# EAGLE design pda6502 (EAGLE 7.1.0)
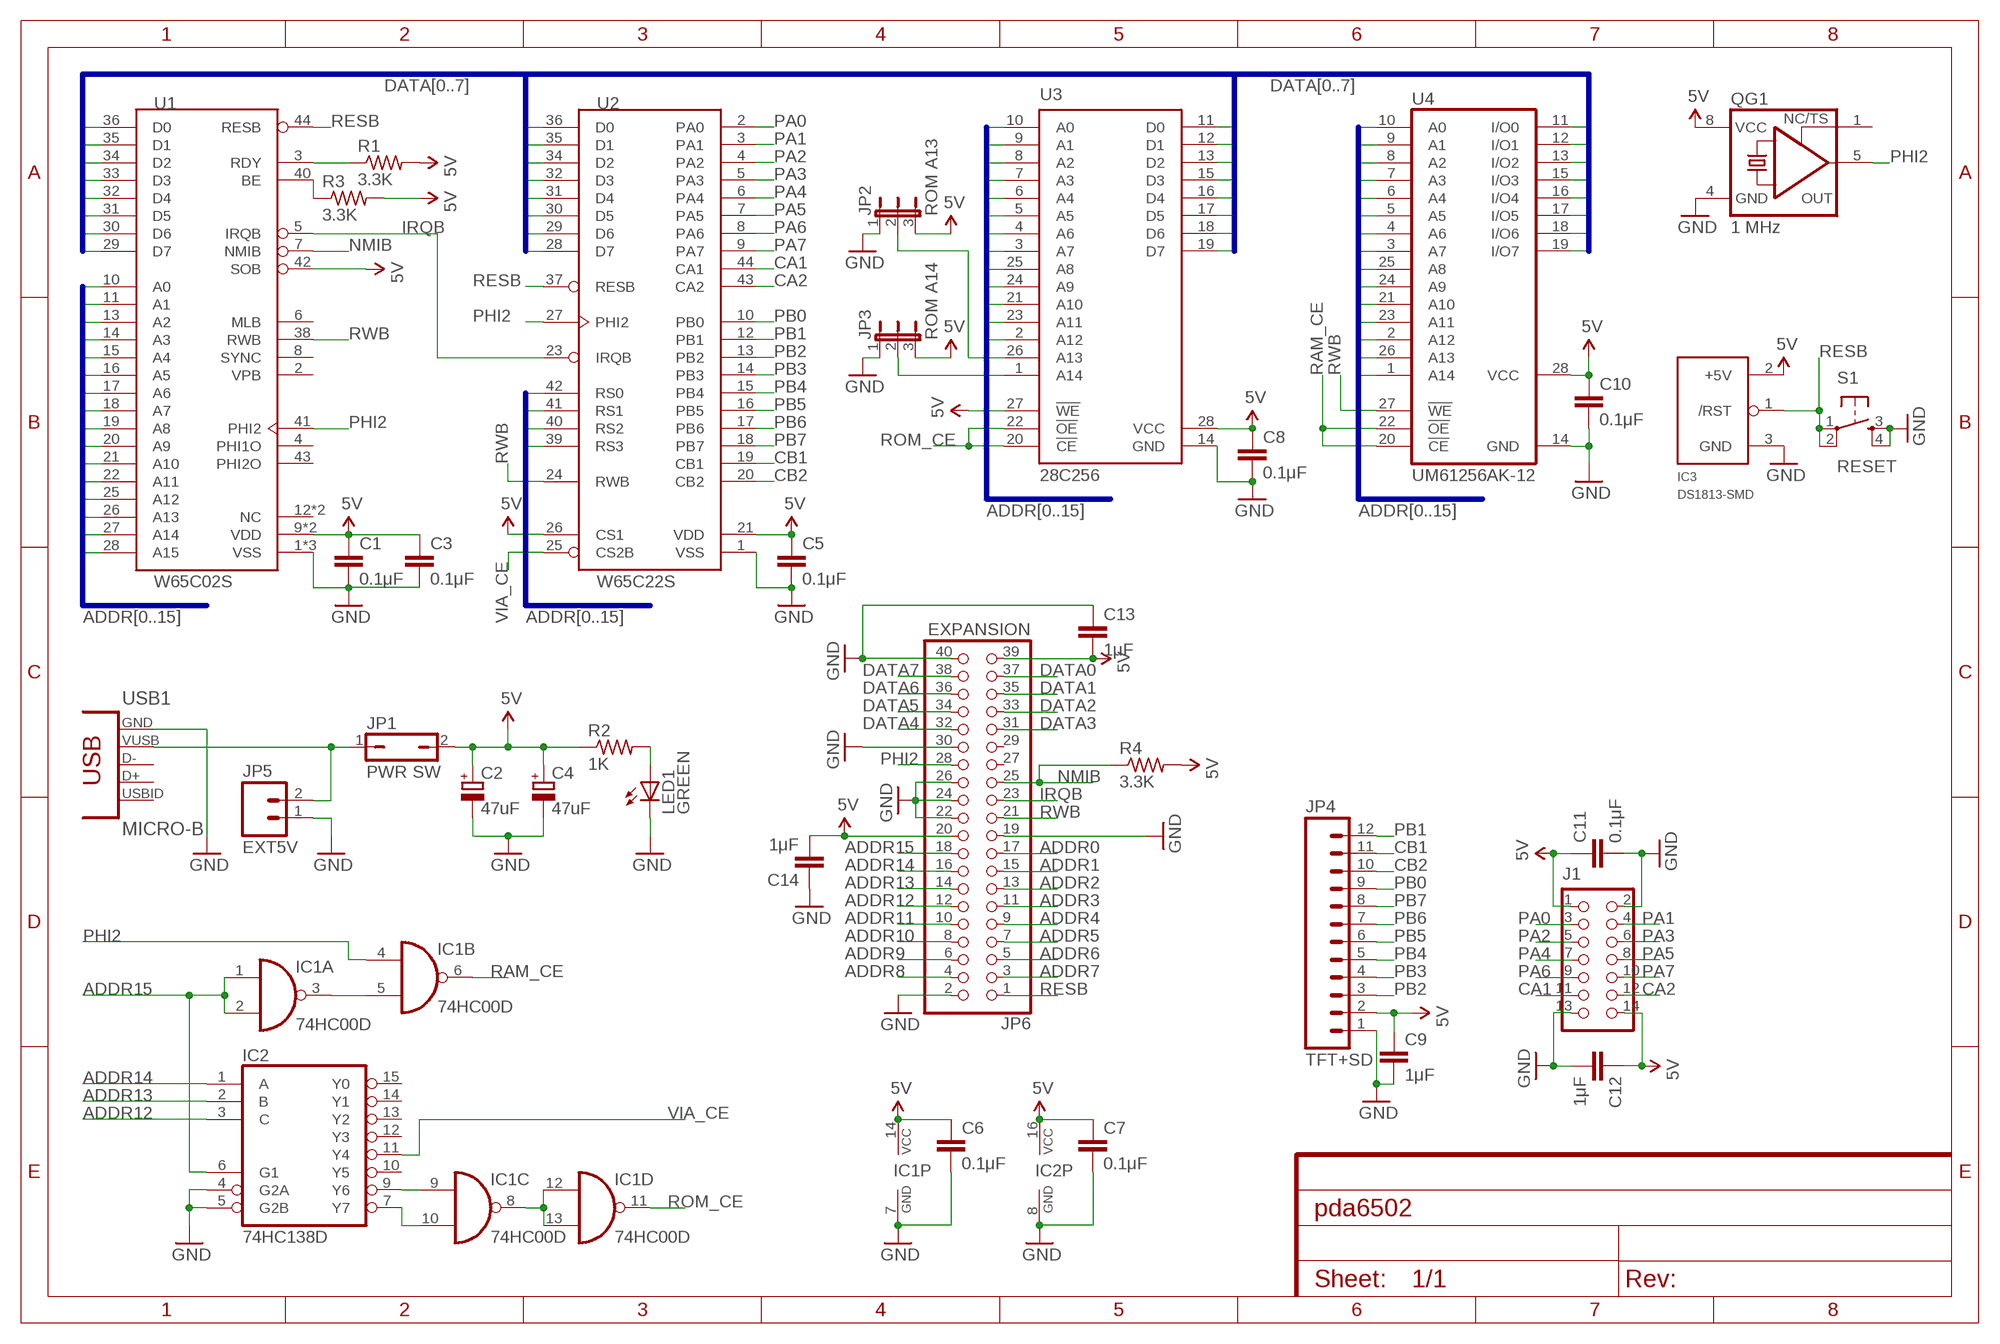
[diagram p0: schematic, sheet 1]
FRAME1 (FRAME-A4L): CNAME: pda; CREVISION: 1.0; DESIGNER: pda

## Parts
C1  0.1μF  C-EUC0805  [C0805]
C2  47uF  CAPACITOR_POL-CASE_B  [CASE_B]
C3  0.1μF  C-EUC0805  [C0805]
C4  47uF  CAPACITOR_POL-CASE_B  [CASE_B]
C5  0.1μF  C-EUC0805  [C0805]
C6  0.1μF  C-EUC0805  [C0805]
C7  0.1μF  C-EUC0805  [C0805]
C8  0.1μF  C-EUC0805  [C0805]
C9  1μF  C-EUC0805  [C0805]
C10  0.1μF  C-EUC0805  [C0805]
C11  0.1μF  C-EUC0805  [C0805]
C12  1μF  C-EUC0805  [C0805]
C13  1μF  C-EUC0805  [C0805]
C14  1μF  C-EUC0805  [C0805]
IC1  74HC00D  [SO14]
IC2  74HC138D  [SO16]
IC3  DS1813-SMD  [SOT-23]
J1  CON_HEADER_2X07-PTH  [M2X7]
JP1  PWR SW  JMP-1X2TH  [JMP-1X2]
JP2  ROM A13  JP2E  [JP2]
JP3  ROM A14  JP2E  [JP2]
JP4  TFT+SD  M121X12_NO_SILK_KIT  [1X12_NO_SILK_KIT]
JP5  EXT5V  M02PTH  [1X02]
JP6  EXPANSION  PINHD-2X20  [2X20]
LED1  GREEN  LED-0805  [LED-805]
QG1  1 MHz  XO-8  [DIL08S]
R1  3.3K  R-US_R0805  [R0805]
R2  1K  R-US_R0805  [R0805]
R3  3.3K  R-US_R0805  [R0805]
R4  3.3K  R-US_R0805  [R0805]
S1  RESET  TAC_SWITCHSMD  [TACTILE-SWITCH-SMD]
U1  W65C02S  W65C02PLCC44  [PLCC44-SOCKET]
U2  W65C22S  W65C22PLCC44-SOCKET  [PLCC44-SOCKET]
U3  28C256  28C256-ZIF  [ZIF28-6-WIDE]
U4  UM61256AK-12  [DIL28-3]
USB1  MICRO-B  CON-USB-F-MICRO-B  [CONN_USB_MICRO-B]

## Nets
5V: C1.1 C2.+ C3.1 C4.+ C5.1 C6.1 C7.1 C8.1 C9.1 C10.1 C11.1 C12.1 C13.2 C14.2 IC1.14(P:VCC) IC2.16(VCC) IC3.2(+5V) J1.1 J1.14 JP1.2 JP2.3 JP3.3 JP4.2 JP6.20 JP6.39 QG1.8(VCC) R1.2 R2.1 R3.2 R4.2 U1.9(VDD) U1.37(VDD) U1.42(SOB) U2.21(VDD) U2.26(CS1) U3.27(!WE) U3.28(VCC) U4.28(VCC)
ADDR0: JP6.17 U1.10(A0) U2.42(RS0) U3.10(A0) U4.10(A0)
ADDR1: JP6.15 U1.11(A1) U2.41(RS1) U3.9(A1) U4.9(A1)
ADDR2: JP6.13 U1.13(A2) U2.40(RS2) U3.8(A2) U4.8(A2)
ADDR3: JP6.11 U1.14(A3) U2.39(RS3) U3.7(A3) U4.7(A3)
ADDR4: JP6.9 U1.15(A4) U3.6(A4) U4.6(A4)
ADDR5: JP6.7 U1.16(A5) U3.5(A5) U4.5(A5)
ADDR6: JP6.5 U1.17(A6) U3.4(A6) U4.4(A6)
ADDR7: JP6.3 U1.18(A7) U3.3(A7) U4.3(A7)
ADDR8: JP6.4 U1.19(A8) U3.25(A8) U4.25(A8)
ADDR9: JP6.6 U1.20(A9) U3.24(A9) U4.24(A9)
ADDR10: JP6.8 U1.21(A10) U3.21(A10) U4.21(A10)
ADDR11: JP6.10 U1.22(A11) U3.23(A11) U4.23(A11)
ADDR12: IC2.3(C) JP6.12 U1.25(A12) U3.2(A12) U4.2(A12)
ADDR13: IC2.2(B) JP6.14 U1.26(A13) U4.26(A13)
ADDR14: IC2.1(A) JP6.16 U1.27(A14) U4.1(A14)
ADDR15: IC1.1(A:I0) IC1.2(A:I1) IC2.6(G1) JP6.18 U1.28(A15)
CA1: J1.11 U2.44(CA1)
CA2: J1.12 U2.43(CA2)
CB1: JP4.11 U2.19(CB1)
CB2: JP4.10 U2.20(CB2)
DATA0: JP6.37 U1.36(D0) U2.36(D0) U3.11(D0) U4.11(I/O0)
DATA1: JP6.35 U1.35(D1) U2.35(D1) U3.12(D1) U4.12(I/O1)
DATA2: JP6.33 U1.34(D2) U2.34(D2) U3.13(D2) U4.13(I/O2)
DATA3: JP6.31 U1.33(D3) U2.32(D3) U3.15(D3) U4.15(I/O3)
DATA4: JP6.32 U1.32(D4) U2.31(D4) U3.16(D4) U4.16(I/O4)
DATA5: JP6.34 U1.31(D5) U2.30(D5) U3.17(D5) U4.17(I/O5)
DATA6: JP6.36 U1.30(D6) U2.29(D6) U3.18(D6) U4.18(I/O6)
DATA7: JP6.38 U1.29(D7) U2.28(D7) U3.19(D7) U4.19(I/O7)
GND: C1.2 C2.- C3.2 C4.- C5.2 C6.2 C7.2 C8.2 C9.2 C10.2 C11.2 C12.2 C13.1 C14.1 IC1.7(P:GND) IC2.4(G2A) IC2.5(G2B) IC2.8(GND) IC3.3(GND) J1.2 J1.13 JP2.1 JP3.1 JP4.1 JP5.1 JP6.2 JP6.19 JP6.22 JP6.24 JP6.26 JP6.30 JP6.40 LED1.C QG1.4(GND) S1.3 S1.4 U1.1(VSS) U1.23(VSS) U1.24(VSS) U2.1(VSS) U3.14(GND) U4.14(GND) USB1.P5(GND)
IRQB: JP6.23 U1.5(IRQB) U2.23(IRQB)
N$1: LED1.A R2.2
N$2: IC1.10(C:I1) IC2.7(Y7)
N$3: IC1.9(C:I0) IC2.9(Y6)
N$4: JP1.1 JP5.2 USB1.P1(VUSB)
N$5: IC1.8(C:O) IC1.12(D:I0) IC1.13(D:I1)
N$6: JP3.2 U3.1(A14)
N$7: IC1.3(A:O) IC1.5(B:I1)
N$8: R3.1 U1.40(BE)
N$9: R1.1 U1.3(RDY)
N$10: JP2.2 U3.26(A13)
NMIB: JP6.25 R4.1 U1.7(NMIB)
PA0: J1.3 U2.2(PA0)
PA1: J1.4 U2.3(PA1)
PA2: J1.5 U2.4(PA2)
PA3: J1.6 U2.5(PA3)
PA4: J1.7 U2.6(PA4)
PA5: J1.8 U2.7(PA5)
PA6: J1.9 U2.8(PA6)
PA7: J1.10 U2.9(PA7)
PB0: JP4.9 U2.10(PB0)
PB1: JP4.12 U2.12(PB1)
PB2: JP4.3 U2.13(PB2)
PB3: JP4.4 U2.14(PB3)
PB4: JP4.5 U2.15(PB4)
PB5: JP4.6 U2.16(PB5)
PB6: JP4.7 U2.17(PB6)
PB7: JP4.8 U2.18(PB7)
PHI2: IC1.4(B:I0) JP6.28 QG1.5(OUT) U1.41(PHI2) U2.27(PHI2)
RAM_CE: IC1.6(B:O) U4.20(!CE) U4.22(!OE)
RESB: IC3.1(/RST) JP6.1 S1.1 S1.2 U1.44(RESB) U2.37(RESB)
ROM_CE: IC1.11(D:O) U3.20(!CE) U3.22(!OE)
RWB: JP6.21 U1.38(RWB) U2.24(RWB) U4.27(!WE)
VIA_CE: IC2.11(Y4) U2.25(CS2B)
Unconnected: IC2.10(Y5) IC2.12(Y3) IC2.13(Y2) IC2.14(Y1) IC2.15(Y0) JP6.27 JP6.29 QG1.1(TS) U1.2(VPB) U1.4(PHI1O) U1.6(MLB) U1.8(SYNC) U1.12(NC) U1.39(NC) U1.43(PHI2O) USB1.BODY@1(BODY) USB1.BODY@2(BODY) USB1.BODY@3(BODY) USB1.BODY@4(BODY) USB1.P2(D-) USB1.P3(D+) USB1.P4(USBID)

## Buses
DATA[0..7]
ADDR[0..15]

## Library data of the parts
C1 C3 C5-C14 = rcl:C-EU: CAPACITOR, European symbol
C2 C4 = dangerousprototypes_devices:CAPACITOR_POL: Polarized capacitor in various packages
IC1 = 74xx-eu:74*00: Quad 2-input NAND gate
IC2 = 74xx-eu:74*138: 3-line to 8-line DECODER/DEMULTIPLEXER
IC3 = ds1813:DS1813
J1 = dangerousprototypes_devices:CON_HEADER_2X07: 2x07 pin header
JP1 = pda:JMP-1X2: JUMPER
JP2 JP3 = pda:JP2E: JUMPER
JP4 = pda:M12: Header 12 Standard 12-pin 0.1" header. Use with straight break away headers (SKU : PRT-00116), right angle break away headers (PRT-00553), swiss pins (PRT-00743), machine pins (PRT-00117), and female headers (PRT-00115).
JP5 = SparkFun-Connectors:M02: Standard 2-pin 0.1" header. Use with - straight break away headers ( PRT-00116) - right angle break away headers (PRT-00553) - swiss pins (PRT-00743) - machine pins (PRT-00117) - female headers (PRT-00115) Molex polarized connector foot print use with: PRT-08233 with associated crimp pins and housings. 2.54_SCREWTERM for use with PRT-10571. 3.5mm Screw Terminal footprints for PRT-08084 5mm Screw Terminal footprints for use with PRT-08433
JP6 = pda:PINHD-2X20: PIN HEADER
LED1 = dangerousprototypes_devices:LED: Light Emitting Diode
QG1 = pda:XO-: CRYSTAL; OC_FARNELL: unknown; OC_NEWARK: unknown
R1-R4 = resistor:R-US_: RESISTOR, American symbol
S1 = SparkFun-Electromechanical:TAC_SWITCH: Momentary Switch Button commonly used for reset or general input. Spark Fun Electronics SKU : COM-00097 SMT- SWCH-08247
U1 = pda:W65C02: 8-bit microprocessor based on MOS 6502.
U2 = pda:W65C22: The W65C22 (W65C22N and W65C22S) Versatile Interface Adapter (VIA) is a flexible I/O device for use with the 65xx series microprocessor family. The W65C22 includes functions for programmed control of two peripheral ports (Ports A and B). Two program controlled 8-bit bidirectional peripheral I/O ports allow direct interfacing between the microprocessor and selected peripheral units. Each port has input data latching capability. Two programmable Data Direction Registers (A and B) allow selection of data direction (input or output) on an individual line basis. Also provided are two programmable 16-bit Interval Timer/Counters with latches. Timer 1 may be operated in a One-Shot Interrupt Mode with interrupts on each count to zero, or in a Free-Run Mode with a continuous series of evenly spaced interrupts. Timer 2 functions as both an interval and pulse counter. Serial Data transfers are provided by a serial to parallel/parallel to serial shift register. Application versatility is further increased by various control registers, including an Interrupt Flag Register, an Interrupt Enable Register and two Function Control Registers.
U3 = pda:28C256
U4 = pda:UM61256AK-12: 5V 32K x 8 CMOS 12ns SRAM
USB1 = dangerousprototypes_devices:CON-USB-F: USB Female connector

## Board
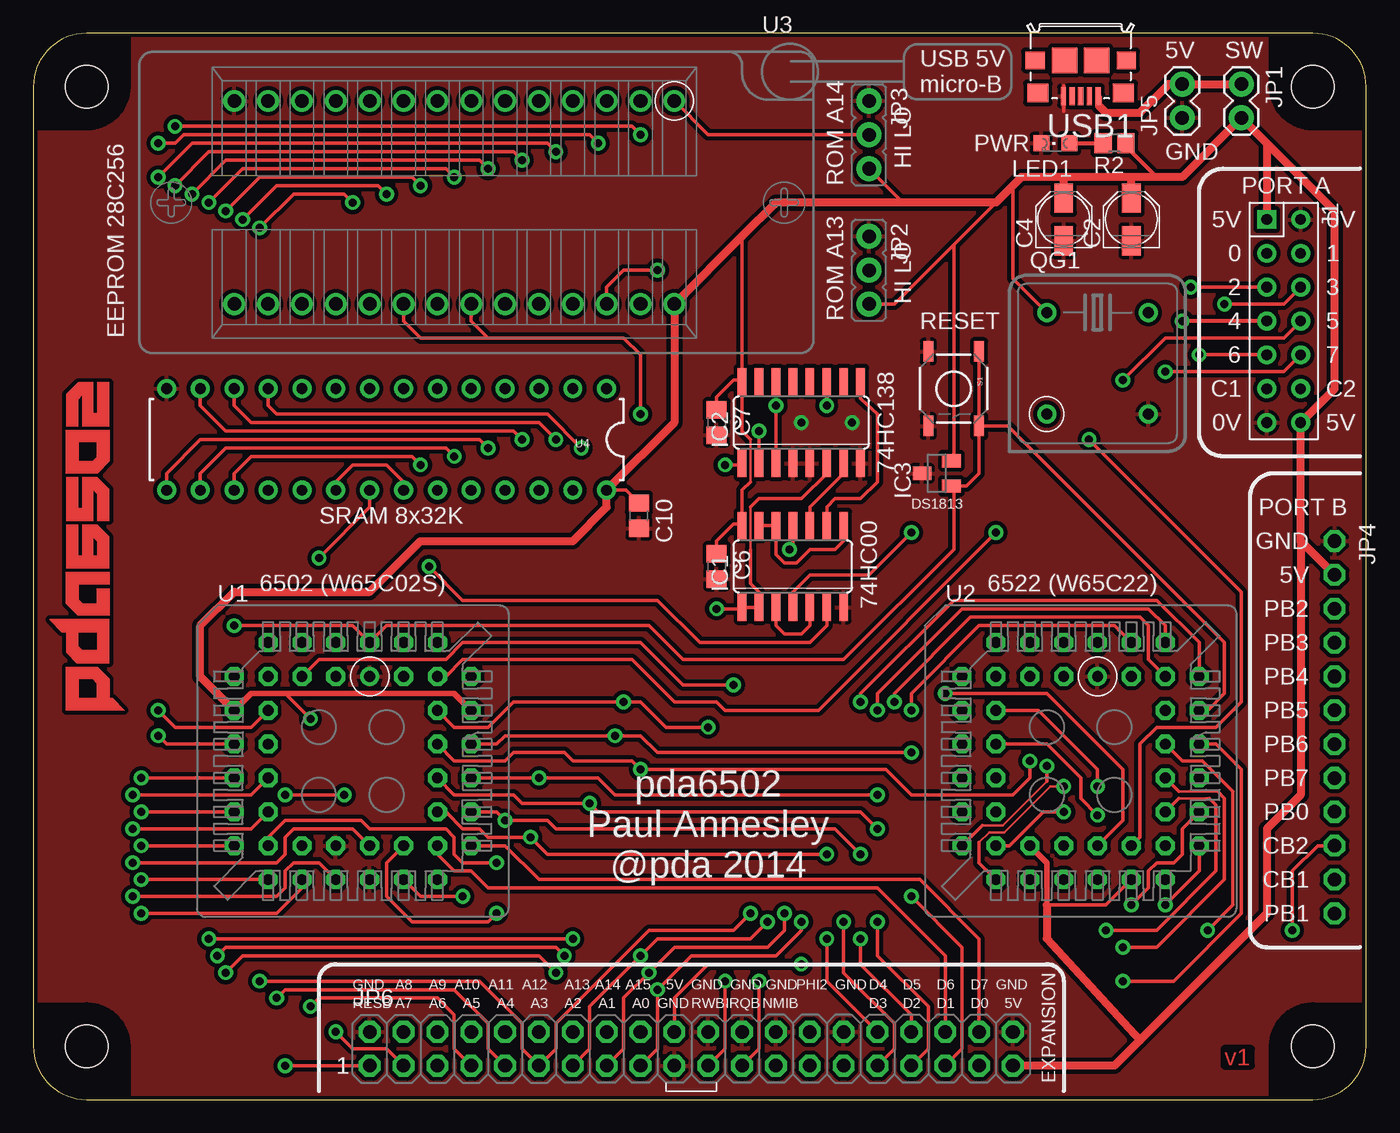
[diagram p1: board, top side]
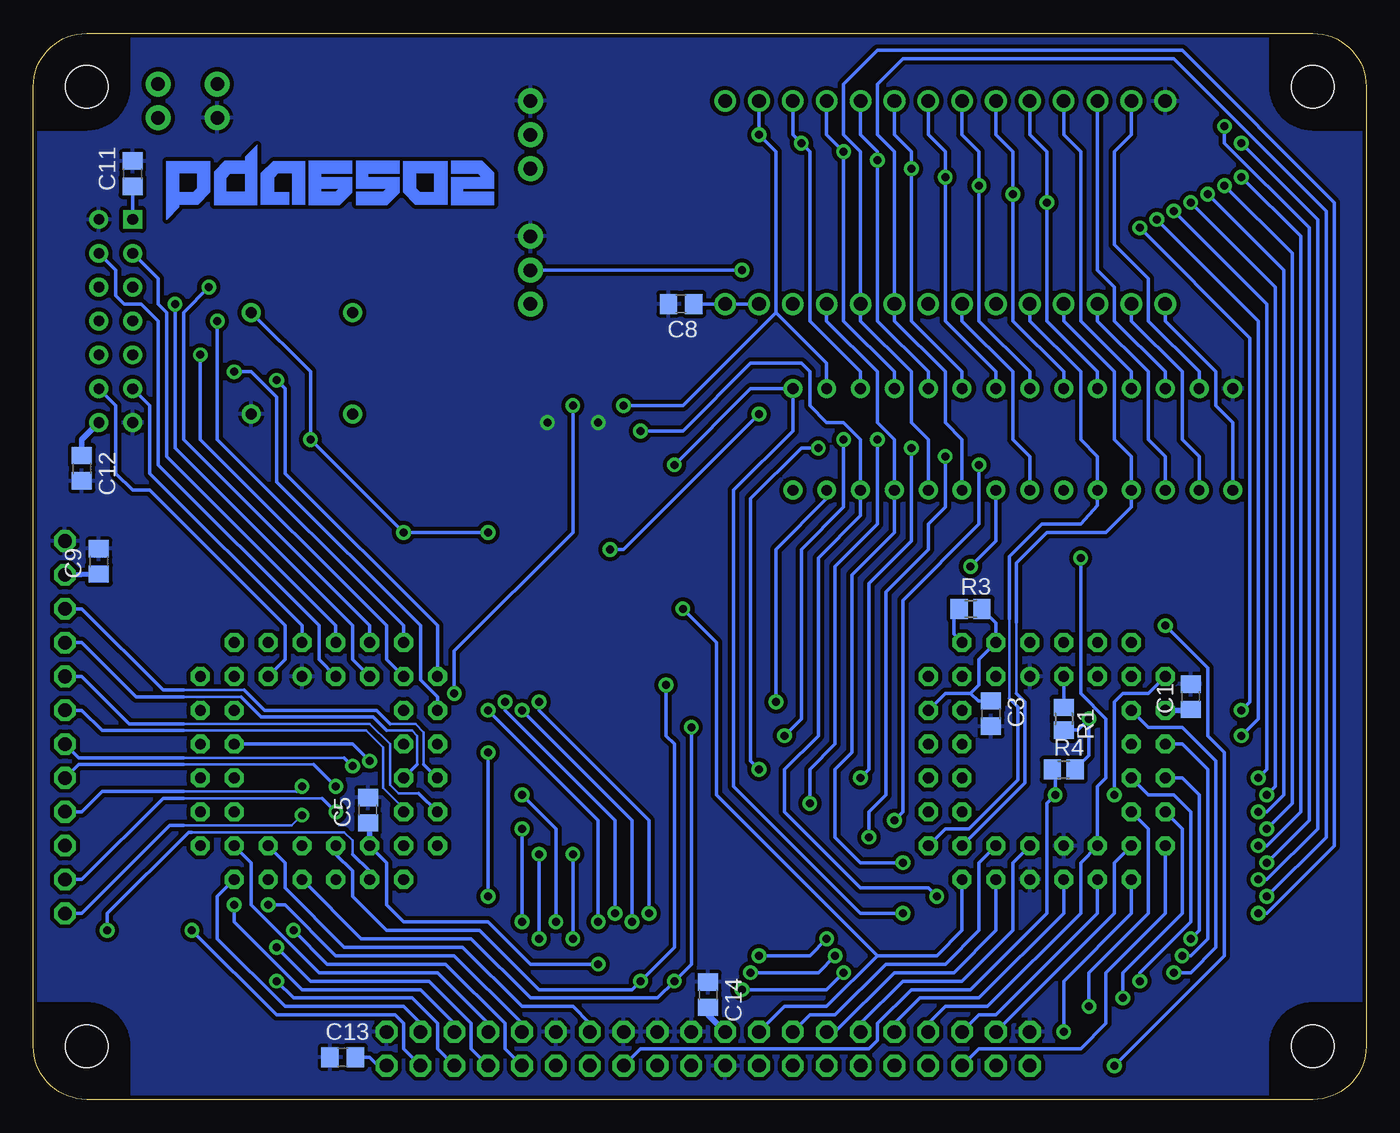
[diagram p2: board, bottom side, seen from below]

Size 100 x 80 mm. Coordinates in mm from the lower left corner, seen from the top.
Copper layers (1*16): Top 0.035mm / dielectric 1.5mm / Bottom 0.035mm
Design rules "SparkFun": minimum track width 8mil, minimum drill 20mil, track to track 8mil, track to pad 8mil, pad to pad 8mil, via to via 8mil, smd to smd 8mil, copper to edge 10mil, drill to drill 8mil, minimum pad ring 12mil, minimum via ring 10mil, stop-mask expansion 4mil, vias tented up to drill 25mil, thermal gap 10mil

### Footprints (pad centres in the part's own frame; a part is rotated, then mirrored left to right if it is on the bottom)
C0805 = smd 1.3 x 1.5: 1 -0.95,0; 2 0.95,0
CASE_B = smd 2.2 x 1.4: + 1.6,0; - -1.6,0
SO14 = smd 0.66 x 2.032: 1 -3.81,-3.073; 2 -2.54,-3.073; 3 -1.27,-3.073; 4 0,-3.073; 5 1.27,-3.073; 6 2.54,-3.073; 7 3.81,-3.073; 8 3.81,3.073; 9 2.54,3.073; 10 1.27,3.073; 11 0,3.073; 12 -1.27,3.073; 13 -2.54,3.073; 14 -3.81,3.073
SO16 = smd 0.66 x 2.032: 1 -4.445,-3.073; 2 -3.175,-3.073; 3 -1.905,-3.073; 4 -0.635,-3.073; 5 0.635,-3.073; 6 1.905,-3.073; 7 3.175,-3.073; 8 4.445,-3.073; 9 4.445,3.073; 10 3.175,3.073; 11 1.905,3.073; 12 0.635,3.073; 13 -0.635,3.073; 14 -1.905,3.073; 15 -3.175,3.073; 16 -4.445,3.073
SOT-23 = smd 1 x 1.4: 1 -0.95,-1.1; 2 0.95,-1.1; 3 0,1.1
M2X7 = drill 0.8 square: 1 -7.62,-1.27 | drill 0.8: 2 -7.62,1.27; 3 -5.08,-1.27; 4 -5.08,1.27; 5 -2.54,-1.27; 6 -2.54,1.27; 7 0,-1.27; 8 0,1.27; 9 2.54,-1.27; 10 2.54,1.27; 11 5.08,-1.27; 12 5.08,1.27; 13 7.62,-1.27; 14 7.62,1.27
JMP-1X2 = drill 1.016 pad 1.88: 1 0,0; 2 2.54,0
JP2 = drill 1.016 pad 1.88: 1 -2.54,0; 2 0,0; 3 2.54,0
1X12_NO_SILK_KIT = drill 1.016 pad 1.524 octagon: 1 0,0; 2 2.54,0; 3 5.08,0; 4 7.62,0; 5 10.16,0; 6 12.7,0; 7 15.24,0; 8 17.78,0; 9 20.32,0; 10 22.86,0; 11 25.4,0; 12 27.94,0
1X02 = drill 1.016 pad 1.88: 1 0,0; 2 2.54,0
2X20 = drill 1.016 octagon: 1 -24.13,-1.27; 2 -24.13,1.27; 3 -21.59,-1.27; 4 -21.59,1.27; 5 -19.05,-1.27; 6 -19.05,1.27; 7 -16.51,-1.27; 8 -16.51,1.27; 9 -13.97,-1.27; 10 -13.97,1.27; 11 -11.43,-1.27; 12 -11.43,1.27; 13 -8.89,-1.27; 14 -8.89,1.27; 15 -6.35,-1.27; 16 -6.35,1.27; 17 -3.81,-1.27; 18 -3.81,1.27; 19 -1.27,-1.27; 20 -1.27,1.27; 21 1.27,-1.27; 22 1.27,1.27; 23 3.81,-1.27; 24 3.81,1.27; 25 6.35,-1.27; 26 6.35,1.27; 27 8.89,-1.27; 28 8.89,1.27; 29 11.43,-1.27; 30 11.43,1.27; 31 13.97,-1.27; 32 13.97,1.27; 33 16.51,-1.27; 34 16.51,1.27; 35 19.05,-1.27; 36 19.05,1.27; 37 21.59,-1.27; 38 21.59,1.27; 39 24.13,-1.27; 40 24.13,1.27
LED-805 = smd 1.2 x 1.2: A 0,-1.05; C 0,1.05
DIL08S = drill 0.813: 1 -3.81,-3.81; 4 3.81,-3.81; 5 3.81,3.81; 8 -3.81,3.81
R0805 = smd 1.3 x 1.5: 1 -0.85,0; 2 0.85,0
TACTILE-SWITCH-SMD = smd 1.524 x 0.762: 1 -2.794,1.905; 2 2.794,1.905; 3 -2.794,-1.905; 4 2.794,-1.905
PLCC44-SOCKET = drill 0.813: 1 1.27,5.08 | drill 0.813 octagon: 2 -1.27,7.62; 3 -1.27,5.08; 4 -3.81,7.62; 5 -3.81,5.08; 6 -6.35,7.62; 7 -8.89,5.08; 8 -6.35,5.08; 9 -8.89,2.54; 10 -6.35,2.54; 11 -8.89,0; 12 -6.35,0; 13 -8.89,-2.54; 14 -6.35,-2.54; 15 -8.89,-5.08; 16 -6.35,-5.08; 17 -8.89,-7.62; 18 -6.35,-10.16; 19 -6.35,-7.62; 20 -3.81,-10.16; 21 -3.81,-7.62; 22 -1.27,-10.16; 23 -1.27,-7.62; 24 1.27,-10.16; 25 1.27,-7.62; 26 3.81,-10.16; 27 3.81,-7.62; 28 6.35,-10.16; 29 8.89,-7.62; 30 6.35,-7.62; 31 8.89,-5.08; 32 6.35,-5.08; 33 8.89,-2.54; 34 6.35,-2.54; 35 8.89,0; 36 6.35,0; 37 8.89,2.54; 38 6.35,2.54; 39 8.89,5.08; 40 6.35,7.62; 41 6.35,5.08; 42 3.81,7.62; 43 3.81,5.08; 44 1.27,7.62
ZIF28-6-WIDE = drill 1.016: 1 -8.89,-6.35; 2 -6.35,-6.35; 3 -3.81,-6.35; 4 -1.27,-6.35; 5 1.27,-6.35; 6 3.81,-6.35; 7 6.35,-6.35; 8 8.89,-6.35; 9 11.43,-6.35; 10 13.97,-6.35; 11 16.51,-6.35; 12 19.05,-6.35; 13 21.59,-6.35; 14 24.13,-6.35; 15 24.13,8.89; 16 21.59,8.89; 17 19.05,8.89; 18 16.51,8.89; 19 13.97,8.89; 20 11.43,8.89; 21 8.89,8.89; 22 6.35,8.89; 23 3.81,8.89; 24 1.27,8.89; 25 -1.27,8.89; 26 -3.81,8.89; 27 -6.35,8.89; 28 -8.89,8.89
DIL28-3 = drill 0.813: 1 -16.51,-3.81; 2 -13.97,-3.81; 3 -11.43,-3.81; 4 -8.89,-3.81; 5 -6.35,-3.81; 6 -3.81,-3.81; 7 -1.27,-3.81; 8 1.27,-3.81; 9 3.81,-3.81; 10 6.35,-3.81; 11 8.89,-3.81; 12 11.43,-3.81; 13 13.97,-3.81; 14 16.51,-3.81; 15 16.51,3.81; 16 13.97,3.81; 17 11.43,3.81; 18 8.89,3.81; 19 6.35,3.81; 20 3.81,3.81; 21 1.27,3.81; 22 -1.27,3.81; 23 -3.81,3.81; 24 -6.35,3.81; 25 -8.89,3.81; 26 -11.43,3.81; 27 -13.97,3.81; 28 -16.51,3.81
DP10080_V1 = hole 3.2: -46,-36; 46,-36; 46,36; -46,36
CONN_USB_MICRO-B = smd 1.6 x 1.4: BODY@1 -3.2,2.45; BODY@2 3.2,2.45 | smd 1.45 x 1.3: BODY@3 3.425,0; BODY@6 -3.425,0 | smd 1.9 x 1.9: BODY@4 1.2,0; BODY@5 -1.2,0 | smd 0.4 x 1.35: P1 -1.3,2.675; P2 -0.65,2.675; P3 0,2.675; P4 0.65,2.675; P5 1.3,2.675

### Placement (x,y rotation side)
C1  13.17,30.22 90 bottom
C2  82.38,66.03 90 top
C3  28.16,28.95 270 bottom
C4  77.31,66.03 90 top
C5  74.89,21.71 90 bottom
C6  51.27,40 270 top
C7  51.27,50.79 270 top
C8  51.4,59.68 180 bottom
C9  95.09,40.38 90 bottom
C10  45.43,43.81 270 top
C11  92.54,69.46 90 bottom
C12  96.35,47.37 270 bottom
C13  76.8,3.17 0 bottom
C14  49.37,7.87 270 bottom
IC1  56.98,40 0 top
IC2  57.62,50.79 0 top
IC3  67.78,46.98 90 top
J1  93.81,58.41 270 top
JP1  90.64,76.19 270 top
JP2  62.7,62.22 270 top
JP3  62.7,72.38 270 top
JP4  97.62,41.9 270 top
JP5  86.19,73.66 90 top
JP6  49.37,3.8 0 top
LED1  76.67,71.75 90 top
QG1  79.84,55.24 0 top
R1  22.7,28.57 270 bottom
R2  81.12,71.75 180 top
R3  29.68,36.82 0 bottom
R4  22.7,24.76 0 bottom
S1  69.05,53.34 270 top
U1  23.96,26.66 0 top
U2  78.57,26.66 0 top
U3  39.2,68.57 180 top
U4  26.51,49.52 180 top
U$1  [DP10080_V1]  50,40 0 top
U$2  [ADA-TFT-240X230-22INCH]  67.15,27.93 0 top
U$3  [PDA6502-LOGO]  6.82,29.2 90 top
U$4  [PDA6502-LOGO]  90,66.03 0 bottom
USB1  78.57,77.97 180 top

### Tracks (layer width: path | path; a pad name or v marks a point on that pad's centre or on a via)
5V  (via drill 0.6)
  Top 0.203: 53.81,49.52 53.81,46.35
  Top 0.254: IC2.16 53.18,50.16 53.81,49.52 | 53.81,46.35 53.18,45.71 IC1.14 | C6.1 51.27,41.9 52.54,43.17 53.07,43.17 | C7.1 51.27,52.7 52.54,53.97 53.07,53.97 IC2.16 | v20.79,28.57 18.89,30.47 | IC2.16 53.18,64.76 | 69.05,64.13 69.05,48.1 IC3.2 | 69.05,64.13 72.22,67.31 | QG1.8 73.5,61.59 73.5,68.57 | JP3.3 65.24,67.31 | JP2.3 64.6,59.68 69.05,64.13 | v57.62,10.15 50.63,10.15 48.09,7.61 JP6.20 | C10.1 44.47,45.71 U4.28 | U2.26 80.48,14.6 76.03,14.6
  Top 0.305: R2.1 81.97,71.53 84.29,69.21
  Top 0.406: U2.21 76.03,17.77 76.03,14.6 | U1.37 31.59,30.47 18.89,30.47 16.35,30.47 U1.9 | 53.07,43.17 IC1.14
  Top 0.61: 92.54,71.75 JP1.2 86.19,69.21 84.29,69.21 82.38,69.21 | 92.54,71.75 J1.1 | 82.38,69.21 77.31,69.21 | 77.31,69.21 74.13,69.21 73.5,68.57 72.22,67.31 65.24,67.31 55.72,67.31 53.18,64.76 U3.28 48.09,50.79 U4.28 43.02,44.45 40.48,41.9 29.05,41.9 25.23,38.09 15.08,38.09 12.54,35.55 12.54,31.74 U1.9 | C4.+ 77.31,69.21 | C2.+ 82.38,69.21 | 92.54,71.75 97.62,66.67 97.62,53.34 J1.14 95.09,41.9 | JP4.2 95.09,41.9 | 95.09,41.9 95.09,22.85 92.54,20.31 92.54,13.96 83.02,4.44 | 83.02,4.44 81.12,2.53 JP6.39 | 76.03,14.6 76.03,12.06 83.02,4.44
  Bottom 0.254: C5.1 74.77,20.31 | U3.27 U3.28 C8.1 | U1.37 31.59,30.47 29.68,30.47 | 29.68,30.47 29.05,31.11 29.05,33.02 U1.42 27.78,35.77 R3.2 | C3.1 29.11,29.9 29.68,30.47 | R1.2 21.64,27.72 v20.79,28.57 20.79,25.81 R4.2 | C11.1 J1.1 | U2.21 73.5,17.77 73.5,14.6 72.22,13.33 65.88,13.33 62.7,10.15 v57.62,10.15 | JP6.39 74.13,2.53 74.77,3.17 C13.2
  Bottom 0.406: J1.14 96.35,49.52 C12.1 | 74.77,20.31 U2.21 | C9.1 JP4.2 | C14.2 49.37,6.34 JP6.20 | C1.1 13.24,29.2 U1.9
ADDR0  (via drill 0.6)
  Top 0.254: v23.96,67.31 23.33,67.94 19.52,67.94 v16.98,65.4 | v9.36,29.2 10.63,27.93 16.35,27.93 U1.10 | U2.42 81.12,35.55 70.96,35.55 65.88,30.47 v65.88,29.2 | JP6.17 46.83,3.8 v46.83,8.25 49.37,10.79 55.72,10.79 57.62,12.69 v57.62,13.33 | v14.44,9.52 15.71,10.79 37.94,10.79 v39.2,9.52
  Bottom 0.254: U4.10 20.16,54.6 23.96,58.41 v23.96,67.31 23.96,71.12 25.23,72.38 U3.10 | v16.98,65.4 8.73,57.14 8.73,29.84 v9.36,29.2 | U1.10 16.35,27.93 13.81,27.93 11.27,25.39 11.27,11.42 13.17,9.52 v14.44,9.52 | v57.62,13.33 57.62,20.95 v65.88,29.2 | v39.2,9.52 40.48,8.25 v46.83,8.25
ADDR1  (via drill 0.6)
  Top 0.254: v26.51,67.94 25.87,68.57 18.25,68.57 v15.71,66.03 | U1.11 10,26.66 v9.36,27.3 | U2.41 83.66,33.02 83.66,35.55 83.02,36.19 70.32,36.19 64.6,30.47 v64.6,29.84 | JP6.15 44.29,3.8 44.29,7.61 v46.19,9.52 48.09,11.42 55.08,11.42 56.35,12.69 v56.35,13.96 | v13.81,10.79 14.44,11.42 39.2,11.42 v39.84,10.79
  Bottom 0.254: U3.9 27.78,72.38 26.51,71.12 v26.51,67.94 26.51,58.41 22.7,54.6 U4.9 | v15.71,66.03 8.09,58.41 8.09,28.57 v9.36,27.3 | U1.11 13.81,26.66 11.9,24.76 11.9,12.06 13.17,10.79 v13.81,10.79 | v56.35,13.96 56.35,20.95 64.6,29.2 v64.6,29.84 | v39.84,10.79 41.11,9.52 v46.19,9.52
ADDR2  (via drill 0.6)
  Top 0.254: v29.05,68.57 28.41,69.21 16.98,69.21 v14.44,66.67 | U1.13 v8.09,24.12 | v63.34,29.2 63.34,30.47 69.69,36.82 83.66,36.82 84.93,35.55 U2.40 | JP6.13 41.74,3.8 41.74,6.98 v45.55,10.79 46.83,12.06 53.81,12.06 v55.08,13.33 | v13.17,12.06 v40.48,12.06
  Bottom 0.254: U3.8 30.32,72.38 29.05,71.12 v29.05,68.57 29.05,58.41 25.23,54.6 U4.8 | v14.44,66.67 7.46,59.68 7.46,24.76 v8.09,24.12 | U1.13 13.81,24.12 12.54,22.85 12.54,12.69 v13.17,12.06 | v55.08,13.33 55.08,20.95 v63.34,29.2 | v40.48,12.06 41.74,10.79 v45.55,10.79
ADDR3  (via drill 0.6)
  Top 0.254: v31.59,69.21 30.95,69.84 15.71,69.84 v13.17,67.31 | v7.46,22.85 16.35,22.85 U1.14 | v16.98,8.88 33.49,8.88 36.66,5.71 36.66,3.8 JP6.11 39.2,3.8 39.2,5.71 46.19,12.69 52.54,12.69 v53.81,13.96 | U2.39 87.47,34.28 84.29,37.46 69.05,37.46 62.06,30.47 v62.06,29.84
  Bottom 0.254: U3.7 32.86,72.38 31.59,71.12 v31.59,69.21 31.59,58.41 27.78,54.6 U4.7 | v13.17,67.31 6.82,60.95 6.82,23.49 v7.46,22.85 | v16.98,8.88 16.98,9.52 13.17,13.33 13.17,21.58 14.44,22.85 16.35,22.85 U1.14 | v53.81,13.96 53.81,20.95 62.06,29.2 v62.06,29.84
ADDR4  (via drill 0.6)
  Top 0.254: v34.12,69.84 33.49,70.48 14.44,70.48 v11.9,67.94 | U1.15 v8.09,21.58 | JP6.9 34.12,3.8 34.12,5.71 31.59,8.25 18.89,8.25 v18.25,7.61
  Bottom 0.254: U3.6 35.4,72.38 34.12,71.12 v34.12,69.84 34.12,58.41 30.32,54.6 U4.6 | v11.9,67.94 6.19,62.22 6.19,22.85 7.46,21.58 v8.09,21.58 | v18.25,7.61 18.25,9.52 13.81,13.96 13.81,20.31 U1.15
ADDR5  (via drill 0.6)
  Top 0.254: v36.66,70.48 36.03,71.12 13.17,71.12 v10.63,68.57 | v7.46,20.31 16.35,20.31 U1.16 | JP6.7 31.59,3.8 31.59,6.34 30.32,7.61 21.43,7.61 v20.79,6.98
  Bottom 0.254: U4.5 32.86,54.6 36.66,58.41 v36.66,70.48 36.66,71.12 37.94,72.38 U3.5 | v10.63,68.57 5.55,63.49 5.55,22.22 v7.46,20.31 | v20.79,6.98 20.79,9.52 16.35,13.96 16.35,20.31 U1.16
ADDR6  (via drill 0.6)
  Top 0.254: v39.2,71.12 38.57,71.75 11.9,71.75 v9.36,69.21 | U1.17 v8.09,19.04
  Bottom 0.254: U4.4 35.4,54.6 39.2,58.41 v39.2,71.12 40.48,72.38 U3.4 | v9.36,69.21 4.92,64.76 4.92,21.58 7.46,19.04 v8.09,19.04 | U1.17 15.08,13.96 19.52,9.52 19.52,5.71 21.43,3.8 29.05,3.8 JP6.5
ADDR7  (via drill 0.6)
  Top 0.254: v42.38,71.75 41.74,72.38 11.27,72.38 10.63,71.75 v9.36,71.75 | U1.18 v8.09,16.5 | JP6.3 26.51,3.8 23.96,3.8 v22.7,5.07
  Bottom 0.254: U4.3 37.94,54.6 41.74,58.41 41.74,71.12 v42.38,71.75 43.02,72.38 U3.3 | v8.09,16.5 7.46,16.5 3.65,20.31 3.65,66.03 v9.36,71.75 | U1.18 17.62,13.96 22.7,8.88 v22.7,5.07
ADDR8  (via drill 0.6)
  Top 0.254: v34.76,17.77 32.22,17.77 31.59,18.41 31.59,19.68 30.95,20.31 25.23,20.31 24.6,20.95 18.89,20.95 17.62,19.68 U1.19
  Bottom 0.254: U3.25 40.48,58.41 36.66,54.6 36.66,50.79 35.4,49.52 U4.25 35.4,42.54 38.57,39.36 38.57,26.03 39.84,24.76 39.84,19.68 37.94,17.77 v34.76,17.77 | JP6.4 18.89,13.96 18.89,17.77 U1.19
ADDR9  (via drill 0.6)
  Top 0.254: U1.20 20.16,15.87 18.25,13.96 v8.09,13.96
  Bottom 0.254: U4.24 32.86,49.52 34.12,50.79 34.12,54.6 37.94,58.41 U3.24 37.94,71.12 39.2,72.38 39.2,76.19 36.66,78.73 13.81,78.73 2.38,67.31 2.38,19.04 7.46,13.96 v8.09,13.96 | JP6.6 29.05,6.34 27.78,6.34 20.16,13.96 U1.20
ADDR10  (via drill 0.6)
  Top 0.254: v21.43,40.63 25.23,44.45 U4.21
  Bottom 0.254: U4.21 25.23,48.25 26.51,49.52 26.51,54.6 30.32,58.41 U3.21 | JP6.8 32.86,5.71 31.59,6.98 28.41,6.98 21.43,13.96 21.43,17.77 U1.21 20.16,23.49 19.52,24.12 19.52,28.57 21.43,30.47 v21.43,40.63
ADDR11  (via drill 0.6)
  Top 0.254: U1.22 21.43,17.77 19.52,17.77 18.89,17.14 18.89,15.87 18.25,15.23 v7.46,15.23
  Bottom 0.254: U4.23 30.32,49.52 31.59,50.79 31.59,54.6 35.4,58.41 U3.23 35.4,71.12 36.66,72.38 36.66,76.19 34.76,78.1 14.44,78.1 3.01,66.67 3.01,19.68 v7.46,15.23 | JP6.10 35.4,5.71 33.49,7.61 29.05,7.61 22.7,13.96 U1.22
ADDR12  (via drill 0.6)
  Top 0.254: v10.63,73.02 44.92,73.02 v45.55,72.38 | U1.25 23.96,20.31 19.52,20.31 18.89,19.68 18.89,18.41 18.25,17.77 v7.46,17.77 | v55.72,52.06 IC2.3
  Bottom 0.254: U3.2 v45.55,72.38 44.29,71.12 44.29,59.05 | 44.29,59.05 40.48,55.24 U4.2 | v10.63,73.02 10.63,71.75 4.28,65.4 4.28,20.95 v7.46,17.77 | JP6.12 37.94,5.71 34.76,8.88 30.32,8.88 26.51,12.69 26.51,17.77 U1.25 | 44.29,59.05 51.27,52.06 v55.72,52.06
ADDR13  (via drill 0.6)
  Top 0.254: v32.22,15.23 29.05,15.23 U1.26 | v54.45,50.16 IC2.2
  Bottom 0.254: JP6.14 39.84,5.07 35.4,9.52 30.95,9.52 27.78,12.69 U1.26 | v32.22,15.23 32.86,15.87 37.94,15.87 43.65,21.58 43.65,24.76 41.11,27.3 41.11,40.63 37.94,43.81 U4.26 37.94,49.52 39.2,50.79 40.48,50.79 41.74,52.06 41.74,54.6 42.38,55.24 46.19,55.24 51.27,50.16 v54.45,50.16
ADDR14  (via drill 0.6)
  Top 0.254: U1.27 26.51,17.77 26.51,15.23 28.41,13.33 34.12,13.33 v34.76,13.96 | v51.91,47.62 53.07,47.62 IC2.1
  Bottom 0.254: JP6.16 41.74,6.34 39.84,6.34 36.03,10.15 31.59,10.15 29.05,12.69 29.05,17.77 U1.27 | v34.76,13.96 37.94,13.96 47.46,23.49 47.46,45.71 43.02,50.16 U4.1 46.19,53.34 v51.91,47.62
ADDR15  (via drill 0.6)
  Top 0.203: 53.81,44.45 53.81,41.27
  Top 0.254: IC2.6 59.52,46.98 57.62,45.08 54.45,45.08 53.81,44.45 | 53.81,41.27 53.81,38.73 54.45,38.09 IC1.2 IC1.1 53.07,36.82 v51.27,36.82
  Bottom 0.254: JP6.18 43.65,6.98 40.48,6.98 36.66,10.79 | U1.28 30.32,12.69 32.22,10.79 36.66,10.79 | v51.27,36.82 48.73,34.28 48.73,22.85 36.66,10.79
CA1
  Bottom 0.254: J1.11 91.28,52.06 91.28,46.98 79.84,35.55 U2.44
CA2
  Bottom 0.254: J1.12 93.81,52.06 93.81,46.98 92.54,45.71 91.28,45.71 81.12,35.55 81.12,33.02 U2.43
CB1  (via drill 0.6)
  Top 0.254: v77.31,21.58 75.78,21.58 73.24,19.04 U2.19
  Bottom 0.203: 88.74,22.6 78.32,22.6
  Bottom 0.254: 78.32,22.6 v77.31,21.58 | 88.74,22.6 90.26,22.6 96.35,16.5 JP4.11
CB2  (via drill 0.6)
  Top 0.254: JP4.10 96.35,19.04 94.45,17.14 v94.45,12.69
  Bottom 0.203: 76.03,18.41 76.03,19.43 76.67,20.06 88.1,20.06
  Bottom 0.254: 76.03,18.41 74.77,17.14 U2.20 | 88.1,20.06 88.35,20.06 94.45,13.96 v94.45,12.69
DATA0  (via drill 0.6)
  Top 0.254: U2.36 86.19,25.39 87.72,25.39 90,23.11 90,14.6 v88.1,12.69 | U4.11 17.62,52.06 18.25,51.43 38.57,51.43 v41.11,48.89 | U1.36 31.59,25.39 35.4,25.39 36.03,26.03 39.84,26.03 40.48,25.39 44.92,25.39 v45.55,24.76 63.97,24.76 65.88,22.85 73.5,22.85 74.77,24.12 v74.77,25.39
  Bottom 0.254: U4.11 17.62,54.6 21.43,58.41 21.43,71.12 22.7,72.38 U3.11 | v45.55,24.76 46.19,25.39 46.19,45.08 42.38,48.89 v41.11,48.89 | v74.77,25.39 76.03,26.66 U2.36 | JP6.37 72.22,3.8 72.22,5.71 72.86,6.34 81.75,6.34 v88.1,12.69
DATA1  (via drill 0.6)
  Top 0.254: U2.35 88.74,26.66 90.64,24.76 90.64,13.96 85.56,8.88 v81.75,8.88 | U4.12 15.08,52.06 16.35,50.79 37.94,50.79 v39.2,49.52 | U1.35 34.76,26.66 35.4,27.3 v43.65,27.3 45.55,27.3 46.83,26.03 v65.88,26.03 | v65.88,15.23 69.69,11.42 69.69,3.8 JP6.35
  Bottom 0.254: U4.12 15.08,54.6 18.89,58.41 18.89,60.95 20.16,62.22 U3.12 | v39.2,49.52 39.2,44.45 42.38,41.27 42.38,28.57 v43.65,27.3 | v65.88,26.03 v65.88,15.23 | JP6.35 69.69,3.8 69.69,5.71 71.59,7.61 80.48,7.61 v81.75,8.88
DATA2  (via drill 0.6)
  Top 0.203: 88.86,23.11 85.94,23.11
  Top 0.254: 88.86,23.11 89.37,22.6 89.37,16.5 84.29,11.42 v81.75,11.42 | 85.94,23.11 U2.34 | U4.13 12.54,52.06 14.44,50.16 36.03,50.16 v36.66,49.52 | U1.34 31.59,22.85 36.03,22.85 36.66,22.22 v41.74,22.22 42.38,21.58 62.06,21.58 v63.34,20.31 | v63.34,13.33 63.34,10.79 67.15,6.98 67.15,3.8 JP6.33
  Bottom 0.254: U4.13 12.54,54.6 16.35,58.41 16.35,61.59 18.89,64.13 18.89,71.12 17.62,72.38 U3.13 | v36.66,49.52 36.66,43.17 39.84,40 39.84,26.66 41.74,24.76 v41.74,22.22 | v63.34,20.31 v63.34,13.33 | JP6.33 67.15,3.8 67.15,5.71 70.32,8.88 79.21,8.88 v81.75,11.42
DATA3  (via drill 0.6)
  Top 0.203: 88.23,22.6 85.94,22.6
  Top 0.254: 88.23,22.6 88.74,22.09 88.74,17.14 84.29,12.69 v80.48,12.69 | 85.94,22.6 U2.32 | U4.15 10,46.98 12.54,49.52 33.49,49.52 v34.12,48.89 | U1.33 v37.94,24.12 42.38,24.12 43.65,22.85 v63.34,22.85 | v60.8,13.33 60.8,9.52 64.6,5.71 64.6,3.8 JP6.31
  Bottom 0.254: U4.15 10,50.79 11.27,52.06 11.27,54.6 15.08,58.41 U3.15 | v34.12,48.89 34.12,41.9 37.3,38.73 37.3,24.76 v37.94,24.12 | v63.34,22.85 60.8,20.31 v60.8,13.33 | JP6.31 64.6,3.8 64.6,5.71 69.05,10.15 77.94,10.15 v80.48,12.69
DATA4  (via drill 0.6)
  Top 0.254: U2.31 86.19,20.31 86.19,18.41 85.56,17.77 84.29,17.77 83.66,17.14 83.66,15.87 v82.38,14.6 | U4.16 12.54,46.98 14.44,48.89 30.95,48.89 v31.59,48.25 | v59.52,18.41 38.57,18.41 v37.3,19.68 34.12,19.68 33.49,20.31 32.22,20.31 30.95,21.58 U1.32 | v59.52,12.06 59.52,8.88 JP6.32
  Bottom 0.254: U4.16 12.54,48.25 13.81,49.52 13.81,54.6 17.62,58.41 U3.16 | JP6.32 63.34,5.71 68.41,10.79 77.31,10.79 81.12,14.6 v82.38,14.6 | v31.59,48.25 31.59,44.45 32.86,43.17 32.86,41.27 36.03,38.09 36.03,22.85 37.3,21.58 v37.3,19.68 | v59.52,18.41 v59.52,12.06
DATA5  (via drill 0.6)
  Top 0.254: U1.31 34.76,21.58 v35.4,20.95 38.57,20.95 39.2,20.31 60.16,20.31 v62.06,18.41 | U4.17 15.08,46.98 16.35,48.25 28.41,48.25 v29.05,47.62 | v62.06,12.06 62.06,10.15 65.88,6.34 JP6.34
  Bottom 0.254: U4.17 15.08,48.25 16.35,49.52 16.35,54.6 20.16,58.41 U3.17 | JP6.34 65.88,5.71 69.69,9.52 78.57,9.52 83.66,14.6 83.66,17.77 U2.30 | v35.4,20.95 34.76,21.58 34.76,37.46 29.05,43.17 v29.05,47.62 | v62.06,18.41 v62.06,12.06
DATA6  (via drill 0.6)
  Top 0.254: v84.93,14.6 87.47,17.14 U2.29 | U1.30 30.32,18.41 31.59,17.14 32.86,17.14 34.12,15.87 63.34,15.87 68.41,10.79 JP6.36
  Bottom 0.203: 26.25,35.81 26.25,30.47
  Bottom 0.254: U3.18 22.7,58.41 18.89,54.6 18.89,49.52 17.62,48.25 U4.18 17.62,44.45 19.52,42.54 23.96,42.54 26.25,40.25 26.25,35.81 | JP6.36 68.41,5.71 70.96,8.25 79.84,8.25 84.93,13.33 v84.93,14.6 | U1.30 25.62,23.74 25.62,29.84 26.25,30.47
DATA7
  Top 0.254: U1.29 35.4,19.04 37.94,16.5 66.51,16.5 70.96,12.06 JP6.38
  Bottom 0.203: 26.76,36.06 26.76,30.09
  Bottom 0.254: U3.19 25.23,58.41 21.43,54.6 21.43,49.52 20.16,48.25 U4.19 20.16,44.57 21.43,43.17 24.35,43.17 26.76,40.76 26.76,36.06 | JP6.38 70.96,5.71 72.22,6.98 81.12,6.98 86.19,12.06 86.19,15.23 U2.28 | U1.29 31.59,20.31 29.81,20.31 26.12,24 26.12,29.46 26.76,30.09
GND  (via drill 0.6)
  Top 0.254: 77.31,76.07 USB1.P5 77.31,74.16
  other vias: 57.62,50.79 61.43,50.79
  pour Top (isolate 0.305): -0.16,80 -0.16,-0.01 100.16,-0.01 100.16,80
  pour Bottom (isolate 0.305): -0.16,80 -0.16,-0.01 100.16,-0.01 100.16,80
IRQB  (via drill 0.6)
  Top 0.254: U1.5 21.43,33.02 30.95,33.02 32.22,34.28 45.55,34.28 48.73,31.11 v52.54,31.11 | JP6.23 54.45,3.8 v54.45,8.88
  Bottom 0.254: U2.23 77.31,18.41 76.03,17.14 76.03,15.23 73.5,12.69 66.51,12.69 62.06,8.25 55.08,8.25 v54.45,8.88 51.91,11.42 51.91,26.66 52.54,27.3 v52.54,31.11
N$1
  Top 0.305: LED1.A R2.2
N$2
  Top 0.254: IC1.10 58.26,44.45 60.8,46.98 IC2.7
N$3
  Top 0.254: IC2.9 62.06,52.6 63.34,51.43 63.34,46.35 62.06,45.08 60.16,45.08 59.52,44.45 IC1.9
N$4
  Top 0.406: USB1.P1 79.97,75.2 79.97,74.54
  Top 0.61: 79.97,74.54 80.48,74.04 83.02,74.04 85.18,76.19 JP5.2 JP1.1
N$5
  Top 0.254: IC1.13 IC1.12 55.72,40.89 56.35,40.25 57.24,40.25 58.26,41.27 60.16,41.27 60.8,41.9 IC1.8
N$6
  Top 0.254: JP3.2 50.63,72.38 U3.1
N$7
  Top 0.254: IC1.3 55.72,35.55 56.35,34.92 57.62,34.92 58.26,35.55 IC1.5
N$8
  Bottom 0.254: U1.40 30.95,34.92 30.95,36.4 R3.1
N$9
  Bottom 0.254: U1.3 R1.1
N$10  (via drill 0.6)
  Top 0.254: U3.26 43.02,60.95 44.29,62.22 v46.83,62.22
  Bottom 0.254: v46.83,62.22 JP2.2
NMIB  (via drill 0.6)
  Top 0.254: v18.89,22.85 v23.33,22.85
  Bottom 0.254: U1.7 16.35,30.47 18.25,30.47 18.89,29.84 v18.89,22.85 | JP6.25 54.45,3.8 37.3,3.8 36.66,4.44 36.66,5.71 34.12,8.25 29.68,8.25 23.96,13.96 23.96,22.22 v23.33,22.85 23.33,24.54 R4.1
PA0
  Bottom 0.254: U2.2 77.31,35.55 90,48.25 90,59.05 90.64,59.68 90.64,61.59 J1.3
PA1
  Bottom 0.254: J1.4 93.81,62.22 93.81,60.32 93.18,59.68 91.91,59.68 90.64,58.41 90.64,47.62 78.57,35.55 78.57,33.02 U2.3
PA2  (via drill 0.6)
  Top 0.254: J1.5 v86.83,60.95
  Bottom 0.254: U2.4 74.77,35.55 88.74,49.52 88.74,59.05 v86.83,60.95
PA3  (via drill 0.6)
  Top 0.254: J1.6 93.81,59.68 v89.37,59.68
  Bottom 0.254: v89.37,59.68 89.37,48.89 76.03,35.55 76.03,33.02 U2.5
PA4  (via drill 0.6)
  Top 0.305: J1.7 v86.19,58.41
  Bottom 0.254: v86.19,58.41 86.19,49.52 72.22,35.55 U2.6
PA5  (via drill 0.6)
  Top 0.254: J1.8 93.81,57.14 84.93,57.14 v81.75,53.97
  Bottom 0.254: v81.75,53.97 81.12,53.34 81.12,46.98 69.69,35.55 U2.7
PA6  (via drill 0.6)
  Top 0.254: J1.9 v87.47,55.88
  Bottom 0.254: v87.47,55.88 87.47,49.52 73.5,35.55 73.5,33.02 U2.8
PA7  (via drill 0.6)
  Top 0.254: J1.10 93.81,54.6 v84.93,54.6
  Bottom 0.254: v84.93,54.6 83.66,54.6 81.75,52.7 81.75,46.35 70.96,35.55 70.96,31.49 69.69,30.22 U2.9
PB0  (via drill 0.6)
  Top 0.254: U2.10 75.4,29.2 79.84,24.76 v79.84,23.49
  Bottom 0.203: 80.23,23.11 88.74,23.11
  Bottom 0.254: v79.84,23.49 80.23,23.11 | 88.74,23.11 94.83,23.11 96.35,21.58 JP4.9
PB1  (via drill 0.6)
  Top 0.254: U2.12 76.03,26.66 78.57,24.12 78.57,22.6 v79.84,21.33
  Bottom 0.203: v79.84,21.33 80.61,20.57 88.74,20.57
  Bottom 0.254: 88.74,20.57 89.75,20.57 96.35,13.96 JP4.12
PB2
  Bottom 0.203: 70.7,25.14 70.7,27.55 71.34,28.19 73.24,28.19 | 84.16,30.73 88.74,30.73
  Bottom 0.254: JP4.3 96.35,36.82 90.26,30.73 88.74,30.73 | 70.7,25.14 U2.13 | 73.24,28.19 74.26,29.2 82.64,29.2 84.16,30.73
PB3
  Bottom 0.203: 71.21,25.14 71.21,27.3 71.59,27.68 73.5,27.68 | 84.42,30.22 88.74,30.22
  Bottom 0.254: 71.21,25.14 U2.14 | JP4.4 96.35,34.28 92.29,30.22 88.74,30.22 | 73.5,27.68 74.51,28.7 82.89,28.7 84.42,30.22
PB4
  Bottom 0.203: 88.74,28.19 74.77,28.19 73.24,26.66 73.24,23.62 72.61,22.98 71.08,22.98
  Bottom 0.254: 71.08,22.98 U2.15 | 88.74,28.19 92.8,28.19 96.35,31.74 JP4.5
PB5
  Bottom 0.203: 88.74,27.68 75.02,27.68 73.75,26.41 73.75,23.36 72.22,21.84 U2.16
  Bottom 0.254: 88.74,27.68 94.83,27.68 96.35,29.2 JP4.6
PB6  (via drill 0.6)
  Top 0.203: 71.21,20.57 72.73,20.57 76.03,23.87
  Top 0.254: U2.17 71.21,20.57 | 76.03,23.87 v76.03,25.01
  Bottom 0.203: 76.67,25.65 88.74,25.65
  Bottom 0.254: v76.03,25.01 76.67,25.65 | 88.74,25.65 96.61,25.65 JP4.7
PB7  (via drill 0.6)
  Top 0.203: 70.96,19.3 71.72,20.06 72.86,20.06 76.29,23.49 v77.31,23.49
  Top 0.254: U2.18 70.96,17.77 70.96,19.3
  Bottom 0.203: 88.74,25.14 78.96,25.14
  Bottom 0.254: 78.96,25.14 v77.31,23.49 | 88.74,25.14 96.61,25.14 JP4.8
PHI2  (via drill 0.6)
  Top 0.254: U2.27 83.02,19.68 83.02,26.66 84.29,27.93 88.74,27.93 90.64,29.84 90.64,38.09 v79.21,49.52 | v72.22,42.54 58.89,29.2 51.91,29.2 51.27,29.84 48.09,29.84 44.92,33.02 32.22,33.02 30.95,31.74 U1.41 | IC1.4 56.98,38.09 58.26,39.36 62.7,39.36 v65.88,42.54
  Bottom 0.254: U2.27 81.12,17.77 81.12,15.87 76.67,11.42 67.78,11.42 63.34,6.98 59.52,6.98 58.26,5.71 JP6.28 | v65.88,42.54 v72.22,42.54 v79.21,49.52 79.21,54.6 QG1.5
RAM_CE  (via drill 0.6)
  Top 0.254: U4.20 22.7,46.35 23.96,47.62 26.51,47.62 27.78,46.35 U4.22 | v29.68,40 32.22,37.46 46.83,37.46 50,34.28 58.26,34.28 59.52,35.55 IC1.6
  Bottom 0.254: v29.68,40 27.78,41.9 U4.22
RESB  (via drill 0.6)
  Top 0.254: S1.2 S1.1 | JP6.1 v18.89,2.53 | v15.08,35.55 23.96,35.55 U1.44 26.51,35.55 46.19,35.55 48.73,33.02 60.8,33.02 69.05,41.27 69.05,45.86 IC3.1 70,46.03 70.96,46.98 S1.2 | U2.37 88.1,29.2 89.37,30.47 89.37,34.28 73.11,50.54 S1.2
  Bottom 0.254: v18.89,2.53 10.63,10.79 10.63,26.03 11.9,27.3 11.9,32.38 v15.08,35.55
ROM_CE  (via drill 0.6)
  Top 0.254: U3.22 32.86,58.41 34.12,57.14 | 34.12,57.14 44.29,57.14 45.55,55.88 v45.55,51.43 | U3.20 27.78,58.41 29.05,57.14 34.12,57.14 | IC1.11 56.98,41.52 v56.73,41.27
  Bottom 0.254: v45.55,51.43 55.72,41.27 v56.73,41.27
RWB  (via drill 0.6)
  Top 0.254: U1.38 31.59,27.93 34.12,27.93 36.03,29.84 v44.29,29.84 45.55,29.84 47.46,27.93 v50.63,27.93 | JP6.21 51.91,3.8 v51.91,8.88
  Bottom 0.254: U4.27 40.48,45.08 44.29,41.27 v44.29,29.84 | U2.24 75.4,12.06 67.15,12.06 62.7,7.61 53.18,7.61 v51.91,8.88 50.63,10.15 v50.63,27.93
VIA_CE  (via drill 0.6)
  Top 0.254: U2.25 81.75,20.95 81.75,24.76 76.03,30.47 v68.41,30.47 | v59.52,52.06 IC2.11
  Bottom 0.254: v68.41,30.47 68.41,33.65 59.52,42.54 v59.52,52.06

### Text on the board
Top: v1
tPlace: 5V | SW | USB 5V / micro-B | PWR | HI LO | GND | ROM A14 | PORT A | 5V | 0V | 0 | 1 | HI LO | 2 | 3 | ROM A13 | RESET | 4 | 5 | EEPROM 28C256 | 6 | 7 | C1 | C2 | 0V | 5V | 74HC138 | DS1813 | SRAM 8x32K | PORT B | GND | 5V | 6502 (W65C02S) | 6522 (W65C22) | 74HC00 | PB2 | PB3 | PB4 | PB5 | PB6 | pda6502 / Paul Annesley / @pda 2014 | PB7 | PB0 | CB2 | CB1 | PB1 | GND | RESB | A7 | A8 | A6 | A9 | A10 | A5 | A11 | A4 | A12 | A3 | A13 | A2 | A14 | A1 | A15 | A0 | GND | 5V | GND | RWB | IRQB | GND | NMIB | GND | PHI2 | GND | D3 | D4 | D2 | D5 | D1 | D6 | D0 | D7 | GND | 5V | 1 | EXPANSION